# Altium project PCB_Project1.PrjPCB
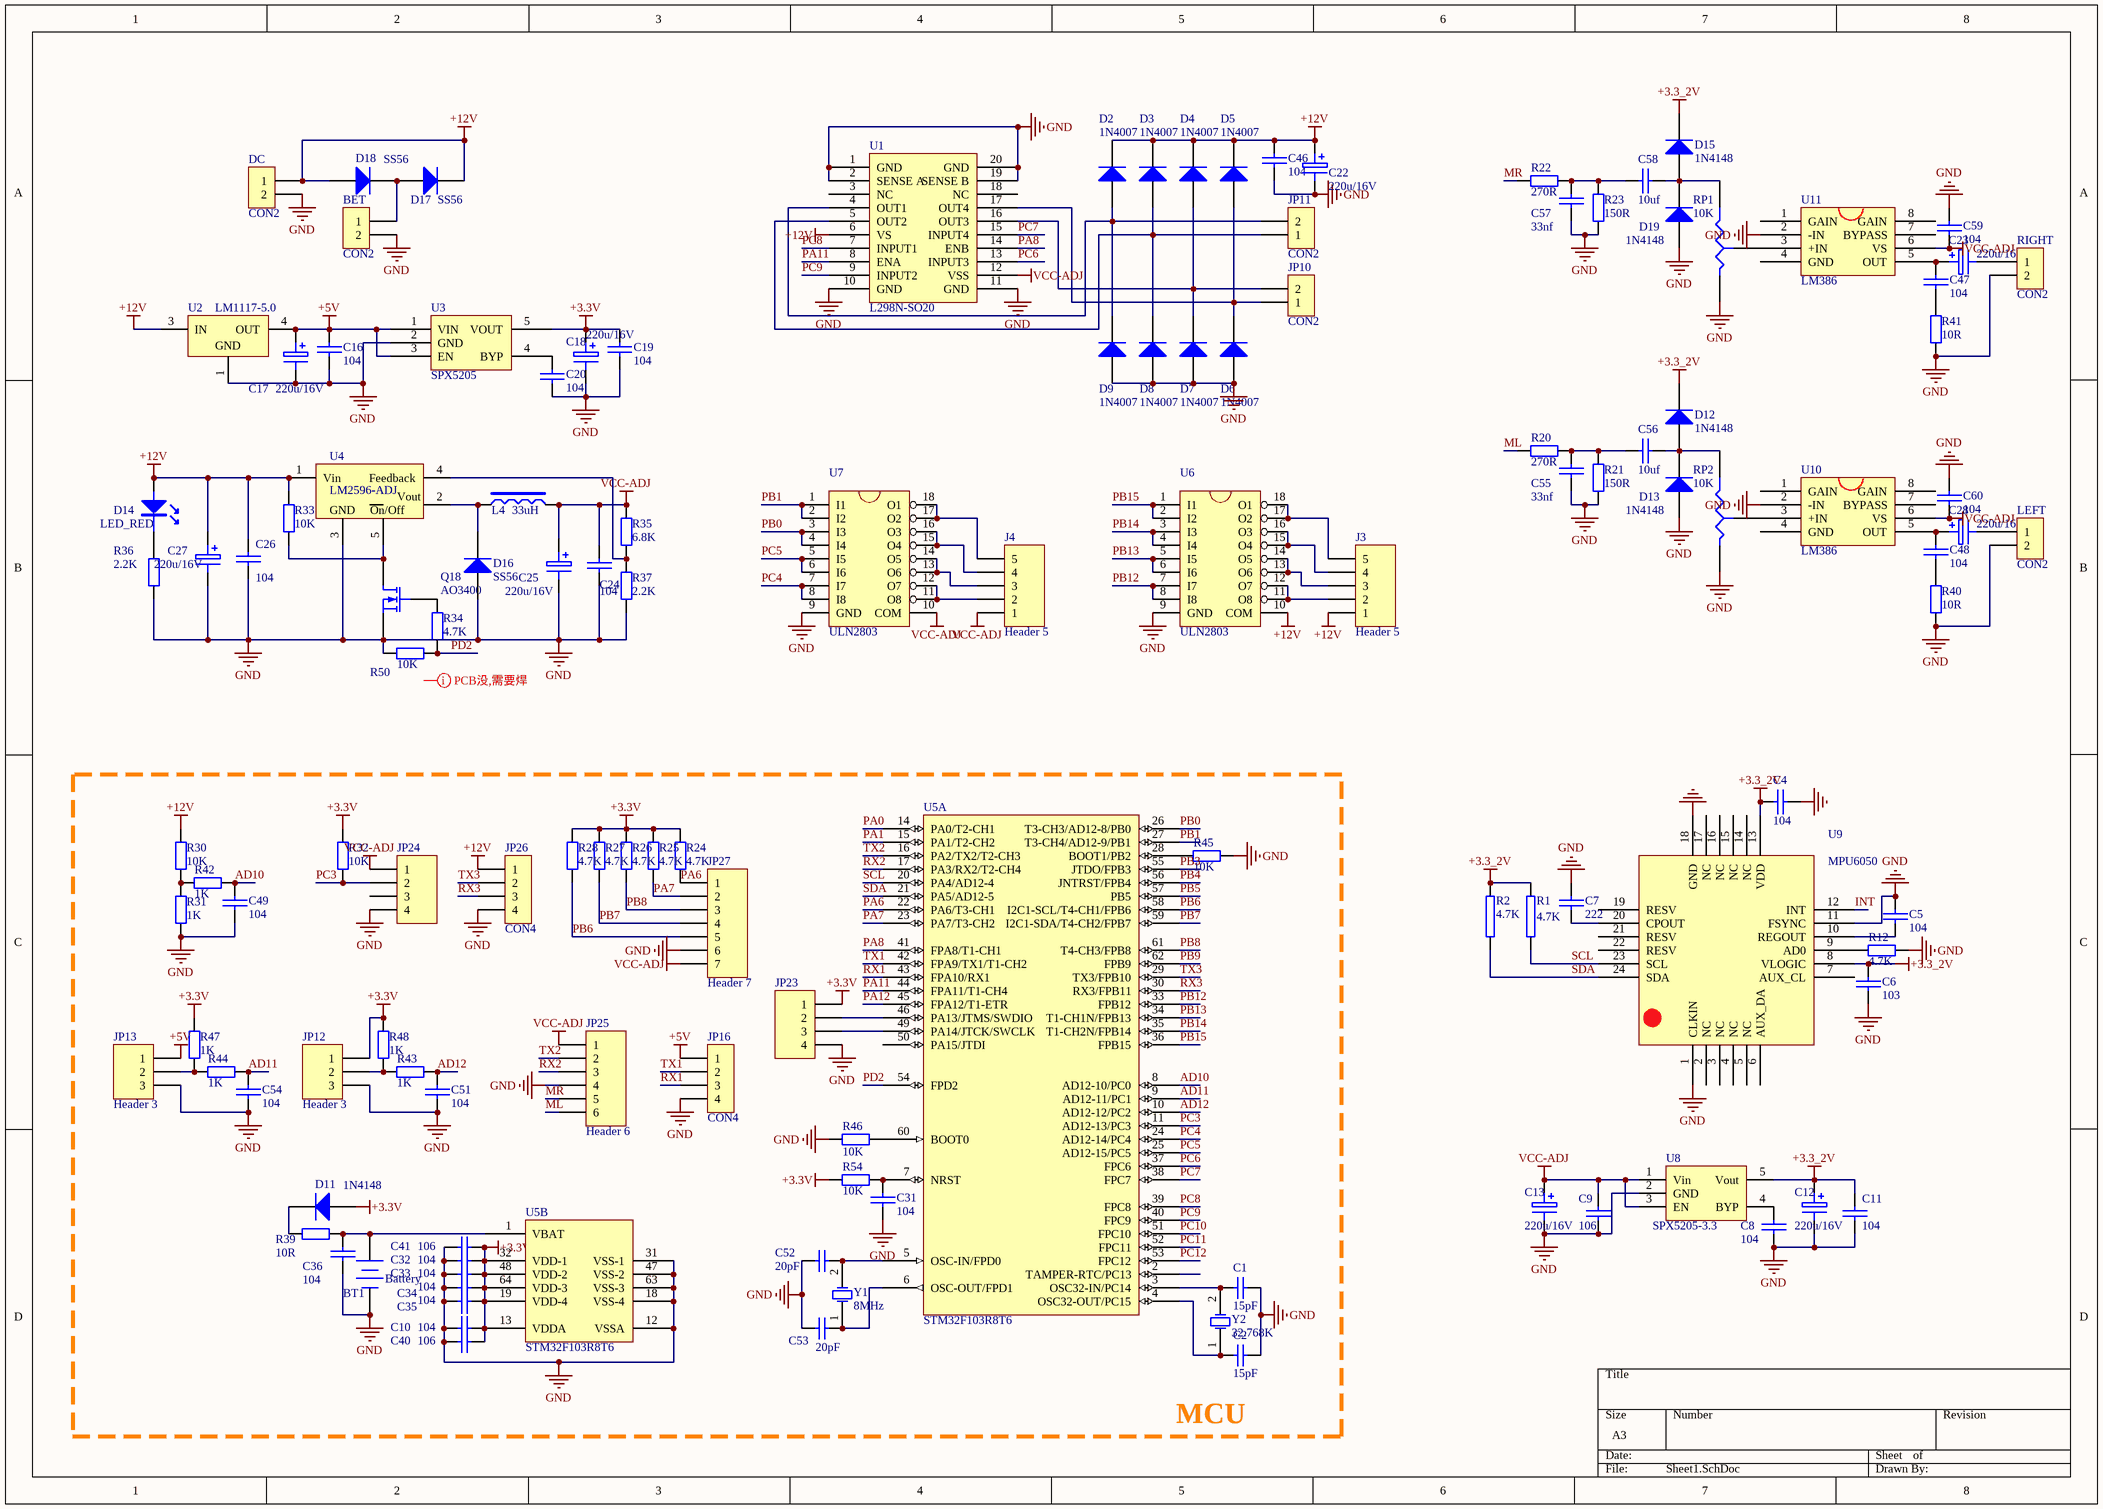
[diagram p0: Sheet1.SchDoc]
1 sheet, 129 parts. Net scope: global (net labels, ports and power ports of the same name join across sheets).
Board file: PCB1.PcbDoc

## Sheet Sheet1.SchDoc
size A3

### Parts
BET  CON2  [2PIN2.54]
BT1  Battery  [BAT-2]
C1  15pF  [0805]
C2  15pF  [0805]
C4  104  [0805]
C5  104  [0805]
C6  103  [0805]
C7  222  [0805]
C8  104  [0805]
C9  106  [0805]
C10  104  [0805]
C11  104  [0805]
C12  220u/16V  [C7542]
C13  220u/16V  [C7542]
C16  104  [0805]
C17  220u/16V  [C7542]
C18  220u/16V  [C7542]
C19  104  [0805]
C20  104  [0805]
C22  220u/16V  [C7542]
C23  220u/16V  [C7542]
C24  104  [0805]
C25  220u/16V  [C7542]
C26  104  [0805]
C27  220u/16V  [C7542]
C28  220u/16V  [C7542]
C31  104  [0805]
C32  104  [0805]
C33  104  [0805]
C34  104  [0805]
C35  104  [0805]
C36  104  [0805]
C40  106  [0805]
C41  106  [0805]
C46  104  [0805]
C47  104  [0805]
C48  104  [0805]
C49  104  [0805]
C51  104  [0805]
C52  20pF  [0805]
C53  20pF  [0805]
C54  104  [0805]
C55  33nf  [0805]
C56  10uf  [0805]
C57  33nf  [0805]
C58  10uf  [0805]
C59  104  [0805]
C60  104  [0805]
D2  1N4007  [SMA]
D3  1N4007  [SMA]
D4  1N4007  [SMA]
D5  1N4007  [SMA]
D6  1N4007  [SMA]
D7  1N4007  [SMA]
D8  1N4007  [SMA]
D9  1N4007  [SMA]
D11  1N4148  [D1206]
D12  1N4148  [D1206]
D13  1N4148  [D1206]
D14  LED_RED  [D0805]
D15  1N4148  [D1206]
D16  SS56  [SMC]
D17  SS56  [SMC]
D18  SS56  [SMC]
D19  1N4148  [D1206]
DC  CON2  [2PIN2.54]
J3  Header 5  [5PIN2.54]
J4  Header 5  [5PIN2.54]
JP10  CON2  [2PIN2.54]
JP11  CON2  [2PIN2.54]
JP12  Header 3  [3PIN2.54]
JP13  Header 3  [3PIN2.54]
JP16  CON4  [4PIN2.54]
JP23  Header 4  [4pin2.54-NEEDLE]  (value not drawn)
JP24  Header 4  [4pin2.54-NEEDLE]  (value not drawn)
JP25  Header 6  [6PIN2.54]
JP26  CON4  [4PIN2.54]
JP27  Header 7  [HDR1X7]
L4  33uH  [SMD-12*12]
LEFT  CON2  [2PIN2.54]
Q18  AO3400  [SOT-23-3]
R1  4.7K  [0805]
R2  4.7K  [0805]
R12  4.7K  [0805]
R20  270R  [0805]
R21  150R  [0805]
R22  270R  [0805]
R23  150R  [0805]
R24  4.7K  [0805]
R25  4.7K  [0805]
R26  4.7K  [0805]
R27  4.7K  [0805]
R28  4.7K  [0805]
R30  10K  [0805]
R31  1K  [0805]
R32  10K  [0805]
R33  10K  [0805]
R34  4.7K  [0805]
R35  6.8K  [0805]
R36  2.2K  [0805]
R37  2.2K  [0805]
R39  10R  [0805]
R40  10R  [0805]
R41  10R  [0805]
R42  1K  [0805]
R43  1K  [0805]
R44  1K  [0805]
R45  10K  [0805]
R46  10K  [0805]
R47  1K  [0805]
R48  1K  [0805]
R50  10K  [0805]
R54  10K  [0805]
RIGHT  CON2  [2PIN2.54]
RP1  10K  [RP]
RP2  10K  [RP]
U1  L298N-SO20  [PowerSO20]
U2  LM1117-5.0  [SOT-223]
U3  SPX5205  [SOT-23-5]
U4  LM2596-ADJ  [TO-263-5]
U5  STM32F103R8T6  [LTQFP64]  (parts A,B of 2)
U6  ULN2803  [SOIC-18]
U7  ULN2803  [SOIC-18]
U8  SPX5205-3.3  [SOT-23-5]
U9  MPU6050  [QFN4*4*0.9_24PIN]
U10  LM386  [SOP-8]
U11  LM386  [SOP-8]
Y1  8MHz  [SMD-5032]
Y2  32.768K  [SMD-5032]

### Blocks framed on the sheet
MCU: BT1 C1 C2 C10 C31-C36 C40 C41 C49 C51-C54 D11 JP12 JP13 JP16 JP23-JP27 R24-R28 R30-R32 R39 R42-R48 R54 U5 Y1 Y2

### Nets
+3.3_2V: C4.1 C6.1 C11.2 C12.1 D12.2(K) D15.2(K) R1.1 R2.1 U8.5(Vout) U9.8(VLOGIC) U9.13(VDD)
+3.3V: C10.1 C18.1 C19.1 C32.2 C33.1 C34.2 C35.2 C40.2 C41.2 D11.1(A) JP12.1 JP23.1 R24.2 R25.2 R26.2 R27.2 R28.2 R32.1 R47.1 R48.1 R54.2 U3.5(VOUT) U5.13(VDDA) U5.19(VDD-4) U5.32(VDD-1) U5.48(VDD-2) U5.64(VDD-3)
+5V: C16.1 C17.1 JP13.1 JP16.1 U2.4(OUT) U3.1(VIN) U3.3(EN)
+12V: C22.1 C26.1 C27.1 C46.2 D2.2(K) D3.2(K) D4.2(K) D5.2(K) D14.A D17.2(K) D18.1(A) DC.1 J3.1 JP26.1 R30.1 R33.1 U1.6(VS) U2.3(IN) U4.1(Vin) U6.10(COM)
GND: BET.2 BT1.2(-) C1.2 C2.2 C4.2 C5.1 C6.2 C7.1 C8.1 C9.1 C10.2 C11.1 C12.2 C13.2 C16.2 C17.2 C18.2 C19.2 C20.2 C22.2 C24.2 C25.2 C26.2 C27.2 C31.1 C32.1 C33.2 C34.1 C35.1 C36.1 C40.1 C41.1 C46.1 C49.2 C51.2 C52.2 C53.2 C54.2 C55.1 C57.1 C59.1 C60.1 D6.1(A) D7.1(A) D8.1(A) D9.1(A) D13.1(A) D16.1(A) D19.1(A) DC.2 JP12.3 JP13.3 JP16.4 JP23.4 JP24.4 JP25.4 JP26.4 JP27.6 LEFT.2 Q18.3(S) R12.1 R21.2 R23.1 R31.2 R36.1 R37.1 R40.1 R41.1 R45.2 R46.1 R50.2 RIGHT.2 RP1.1(A) RP2.1(A) U1.1(GND) U1.2(SENSE_A) U1.10(GND) U1.11(GND) U1.19(SENSE_B) U1.20(GND) U2.1(GND) U3.2(GND) U4.3 U5.12(VSSA) U5.18(VSS-4) U5.31(VSS-1) U5.47(VSS-2) U5.63(VSS-3) U6.9(GND) U7.9(GND) U8.2(GND) U9.1(CLKIN) U9.11(FSYNC) U9.18(GND) U10.2(-IN) U11.2(-IN)
VCC-ADJ: C9.2 C13.1 C24.1 C25.1 C59.2 C60.2 J4.1 JP24.1 JP25.1 JP27.7 L4.2 R35.2 U1.12(VSS) U7.10(COM) U8.1(Vin) U8.3(EN) U10.6(VS) U11.6(VS)
AD10: C49.1 R42.1 U5.8(AD12-10/PC0)
AD11: C54.1 R44.1 U5.9(AD12-11/PC1)
AD12: C51.1 R43.1 U5.10(AD12-12/PC2)
INT: U9.12(INT)
ML: JP25.6 R20.2
MR: JP25.5 R22.1
PA0: U5.14(PA0/T2-CH1)
PA1: U5.15(PA1/T2-CH2)
PA6: JP27.1 R24.1 U5.22(PA6/T3-CH1)
PA7: JP27.2 R25.1 U5.23(PA7/T3-CH2)
PA8: U1.14(ENB) U5.41(FPA8/T1-CH1)
PA11: U1.8(ENA) U5.44(FPA11/T1-CH4)
PA12: U5.45(FPA12/T1-ETR)
PB0: U5.26(T3-CH3/AD12-8/PB0) U7.3(I3) U7.4(I4)
PB1: U5.27(T3-CH4/AD12-9/PB1) U7.1(I1) U7.2(I2)
PB3: U5.55(JTDO/FPB3)
PB4: U5.56(JNTRST/FPB4)
PB5: U5.57(PB5)
PB6: JP27.5 R28.1 U5.58(I2C1-SCL/T4-CH1/FPB6)
PB7: JP27.4 R27.1 U5.59(I2C1-SDA/T4-CH2/FPB7)
PB8: JP27.3 R26.1 U5.61(T4-CH3/FPB8)
PB9: U5.62(FPB9)
PB12: U5.33(FPB12) U6.7(I7) U6.8(I8)
PB13: U5.34(T1-CH1N/FPB13) U6.5(I5) U6.6(I6)
PB14: U5.35(T1-CH2N/FPB14) U6.3(I3) U6.4(I4)
PB15: U5.36(FPB15) U6.1(I1) U6.2(I2)
PC3: JP24.2 R32.2 U5.11(AD12-13/PC3)
PC4: U5.24(AD12-14/PC4) U7.7(I7) U7.8(I8)
PC5: U5.25(AD12-15/PC5) U7.5(I5) U7.6(I6)
PC6: U1.13(INPUT3) U5.37(FPC6)
PC7: U1.15(INPUT4) U5.38(FPC7)
PC8: U1.7(INPUT1) U5.39(FPC8)
PC9: U1.9(INPUT2) U5.40(FPC9)
PC10: U5.51(FPC10)
PC11: U5.52(FPC11)
PC12: U5.53(FPC12)
PD2: R34.2 R50.1 U5.54(FPD2)
RX1: JP16.3 U5.43(FPA10/RX1)
RX2: JP25.3 U5.17(PA3/RX2/T2-CH4)
RX3: JP26.3 U5.30(RX3/FPB11)
SCL: R1.2 U5.20(PA4/AD12-4) U9.23(SCL)
SDA: R2.2 U5.21(PA5/AD12-5) U9.24(SDA)
TX1: JP16.2 U5.42(FPA9/TX1/T1-CH2)
TX2: JP25.2 U5.16(PA2/TX2/T2-CH3)
TX3: JP26.2 U5.29(TX3/FPB10)
NetBET_1: BET.1 D17.1(A) D18.2(K)
NetBT1_1: BT1.1(+) C36.2 R39.2 U5.1(VBAT)
NetC1_1: C1.1 U5.3(OSC32-IN/PC14) Y2.2(OSC2)
NetC2_1: C2.1 U5.4(OSC32-OUT/PC15) Y2.1(OSC1)
NetC5_2: C5.2 U9.10(REGOUT)
NetC7_2: C7.2 U9.20(CPOUT)
NetC8_2: C8.2 U8.4(BYP)
NetC20_1: C20.1 U3.4(BYP)
NetC23_1: C23.1 C47.2 U11.5(OUT)
NetC23_2: C23.2 RIGHT.1
NetC28_1: C28.1 C48.2 U10.5(OUT)
NetC28_2: C28.2 LEFT.1
NetC31_2: C31.2 R54.1 U5.7(NRST)
NetC47_1: C47.1 R41.2
NetC48_1: C48.1 R40.2
NetC52_1: C52.1 U5.5(OSC-IN/FPD0) Y1.2(OSC2)
NetC53_1: C53.1 U5.6(OSC-OUT/FPD1) Y1.1(OSC1)
NetC55_2: C55.2 C56.2 R20.1 R21.1
NetC56_1: C56.1 D12.1(A) D13.2(K) RP2.2(B)
NetC57_2: C57.2 C58.2 R22.2 R23.2
NetC58_1: C58.1 D15.1(A) D19.2(K) RP1.2(B)
NetD2_1: D2.1(A) D9.2(K) JP11.2 U1.4(OUT1)
NetD3_1: D3.1(A) D8.2(K) JP11.1 U1.5(OUT2)
NetD4_1: D4.1(A) D7.2(K) JP10.2 U1.16(OUT3)
NetD5_1: D5.1(A) D6.2(K) JP10.1 U1.17(OUT4)
NetD11_2: D11.2(K) R39.1
NetD14_K: D14.K R36.2
NetD16_2: D16.2(K) L4.1 U4.2
NetJ3_2: J3.2 U6.11(O8) U6.12(O7)
NetJ3_3: J3.3 U6.13(O6) U6.14(O5)
NetJ3_4: J3.4 U6.15(O4) U6.16(O3)
NetJ3_5: J3.5 U6.17(O2) U6.18(O1)
NetJ4_2: J4.2 U7.11(O8) U7.12(O7)
NetJ4_3: J4.3 U7.13(O6) U7.14(O5)
NetJ4_4: J4.4 U7.15(O4) U7.16(O3)
NetJ4_5: J4.5 U7.17(O2) U7.18(O1)
NetJP12_2: JP12.2 R43.2 R48.2
NetJP13_2: JP13.2 R44.2 R47.2
NetJP23_2: JP23.2 U5.46(PA13/JTMS/SWDIO)
NetJP23_3: JP23.3 U5.49(PA14/JTCK/SWCLK)
NetQ18_1: Q18.1(D) R33.2 U4.5
NetQ18_2: Q18.2(G) R34.1
NetR12_2: R12.2 U9.9(AD0)
NetR30_2: R30.2 R31.1 R42.2
NetR35_1: R35.1 R37.2 U4.4(Feedback)
NetR45_1: R45.1 U5.28(BOOT1/PB2)
NetR46_2: R46.2 U5.60(BOOT0)
NetRP1_3: RP1.3(TAP) U11.3(+IN)
NetRP2_3: RP2.3(TAP) U10.3(+IN)

Not connected (* = marked no-connect by the designer): JP24 3; U1 3(NC) 18(NC); U5 2(TAMPER-RTC/PC13) 50(PA15/JTDI); U9 2(NC) 3(NC) 4(NC) 5(NC) 6(AUX_DA) 7(AUX_CL) 14(NC) 15(NC) 16(NC) 17(NC) 19(RESV) 21(RESV) 22(RESV); U10 1(GAIN) 4(GND) 7(BYPASS) 8(GAIN); U11 1(GAIN) 4(GND) 7(BYPASS) 8(GAIN)

### Layout directives
Column: TestVectorIndex: (no net found under the mark)

### Notes on the sheet
- (in symbol LM2575-5) Vout; GND; On/Off

### Library data of the parts
BET DC JP10 JP11 LEFT RIGHT = CON2: Connector
BT1 = Battery: Multicell Battery; Published: 24-Mar-1999; LatestRevisionDate: 17-Jul-2002; LatestRevisionNote: Re-released for DXP Platform.; PackageReference: BAT-2; Publisher: Altium Limited
C1 C2 C52 = Cap: Capacitor; Value: 0.019nF; Published: 8-Jun-2000; LatestRevisionDate: 17-Jul-2002; LatestRevisionNote: Re-released for DXP Platform.; PackageReference: RAD-0.3; Publisher: Altium Limited
C4 = CAP
C5-C11 C16 C19 C20 C24 C26 C31-C36 C46-C49 C51 C54-C60 = CAP_W
C12 C13 C17 C18 C22 C23 C25 C27 C28 = ELECTRO1_W
C40 C41 = Cap: Capacitor; Value: 0.1uF; Published: 8-Jun-2000; LatestRevisionDate: 17-Jul-2002; LatestRevisionNote: Re-released for DXP Platform.; PackageReference: RAD-0.3; Publisher: Altium Limited
C53 = Cap: Capacitor; Value: 22pF; Published: 8-Jun-2000; LatestRevisionDate: 17-Jul-2002; LatestRevisionNote: Re-released for DXP Platform.; PackageReference: RAD-0.3; Publisher: Altium Limited
D2-D9 D11-D13 D15-D19 = Diode: Default Diode; Published: 8-Jun-2000; LatestRevisionDate: 17-Jul-2002; LatestRevisionNote: Re-released for DXP Platform.; PackageVersion: Sep-1996; PackageReference: SMC; Publisher: Altium Limited; Code_JEDEC: DO-214-AB
D14 = Pro5E.tmp_UnNamed_101: pin to pad: A>1 K>2
J3 J4 = Header 5: Header, 5-Pin; LatestRevisionDate: 17-Jul-2002; LatestRevisionNote: Re-released for DXP Platform.; Publisher: Altium Limited
JP12 JP13 = Header 3: Header, 3-Pin; LatestRevisionDate: 17-Jul-2002; LatestRevisionNote: Re-released for DXP Platform.; Publisher: Altium Limited
JP16 JP26 = CON4: Connector
JP23 JP24 = Header 4: Header, 4-Pin; LatestRevisionDate: 17-Jul-2002; LatestRevisionNote: Re-released for DXP Platform.; Publisher: Altium Limited
JP25 = Header 6: Header, 6-Pin; LatestRevisionDate: 17-Jul-2002; LatestRevisionNote: Re-released for DXP Platform.; Publisher: Altium Limited
JP27 = Header 7: Header, 7-Pin; LatestRevisionDate: 17-Jul-2002; LatestRevisionNote: Re-released for DXP Platform.; Publisher: Altium Limited
L4 = Pro4F.tmp_80uh_35
Q18 = MOSFET-N: N-Channel MOSFET; Published: 8-Jun-2000; LatestRevisionDate: 17-Jul-2002; LatestRevisionNote: Re-released for DXP Platform.; PackageVersion: 1995/1996; PackageReference: E3; Publisher: Altium Limited
R1 R2 = RES2: Part Field 1: 0; Part Field 10: 1000u; Part Field 2: 0; Part Field 3: 0; Part Field 4: 0; Part Field 5: 1; Part Field 6: 0; Part Field 7: 1u; Part Field 8: 1u; Part Field 9: 500u
R12 R20-R28 R30 R32-R37 R39-R41 R50 R54 = Res2: Resistor; Value: 1K; Published: 8-Jun-2000; LatestRevisionDate: 17-Jul-2002; LatestRevisionNote: Re-released for DXP Platform.; PackageReference: AXIAL-0.4; Publisher: Altium Limited
  R12 R33-R37 R50: PackageDescription: Axial Device, Thru-Hole; 2 Leads; 0.4 in Pin Spacing
R31 R42-R44 R47 R48 = Res2: Resistor; Published: 8-Jun-2000; LatestRevisionDate: 17-Jul-2002; LatestRevisionNote: Re-released for DXP Platform.; PackageReference: AXIAL-0.4; Publisher: Altium Limited; Value: 1K
R45 R46 = Res2: Resistor; Value: 100K; Published: 8-Jun-2000; LatestRevisionDate: 17-Jul-2002; LatestRevisionNote: Re-released for DXP Platform.; PackageReference: AXIAL-0.4; Publisher: Altium Limited
RP1 RP2 = Res Tap: Tapped Resistor; Sim Note: Enter the Resistance value and the set point into parameter fields.; Set Position: 0.5; Value: 1K; Published: 24-Mar-1999; LatestRevisionDate: 17-Jul-2002; LatestRevisionNote: Re-released for DXP Platform.; PackageReference: VR3; Publisher: Altium Limited
U1 = L298N
U2 = LM1117IDT-3.3: 800mA Low-Dropout Linear Regulator, 3-pin TO-252; Manufacturer: National Semiconductor; PackageTopMarking: NSUZXYTT*LM1117*IDT-3.3; PowerWise: N; CompType: LDO IC; Published: 4-Dec-2008; DatasheetVersion: Apr-2006; PackageVersion: revD, Feb-2009; PackageReference: TD03B; Publisher: Altium Limited; PackageDescription: TO252, Molded, Jedec, 6.8 x 6.10 x 2.30mm Body, 3 Lead, 2.28mm Pitch, Surface Mount; PartNumber: LM1117IDT-3.3; RoHS: N; PinCount: 3; Code_JEDEC: TO-252-AA; ComponentLink1Description: LM1117 Datasheet; ComponentLink1URL: http://www.national.com/ds/LM/LM1117.pdf; ComponentLink2Description: LM1117 Web Page; ComponentLink2URL: http://www.national.com/pf/LM/LM1117.html; ComponentLink3Description: TD03B Package Page; ComponentLink3URL: http://www.national.com/packaging/folders/td03b.html
U3 = SPX5205: VOLTAGE REGULATOR IC
U4 = LM2575-5
U5 = STM32F103R8T6: STM32 ARM-based 32-bit MCU with 64 Kbytes Flash, 64-pin LQFP, Industrial Temperature; Published: *; DatasheetVersion: *; PackageVersion: *; PackageReference: *; Publisher: *; PackageDescription: *; ComponentLink1Description: *; ComponentLink1URL: *; ComponentLink2Description: *; ComponentLink2URL: *
U6 U7 = ULN2803: SOIC
U8 = SPX5205
Y1 Y2 = XTAL: Crystal Oscillator; Published: 8-Jun-2000; LatestRevisionDate: 17-Jul-2002; LatestRevisionNote: Re-released for DXP Platform.; PackageReference: R38; Publisher: Altium Limited